# EAGLE schematic example_board (EAGLE 6.5.0)
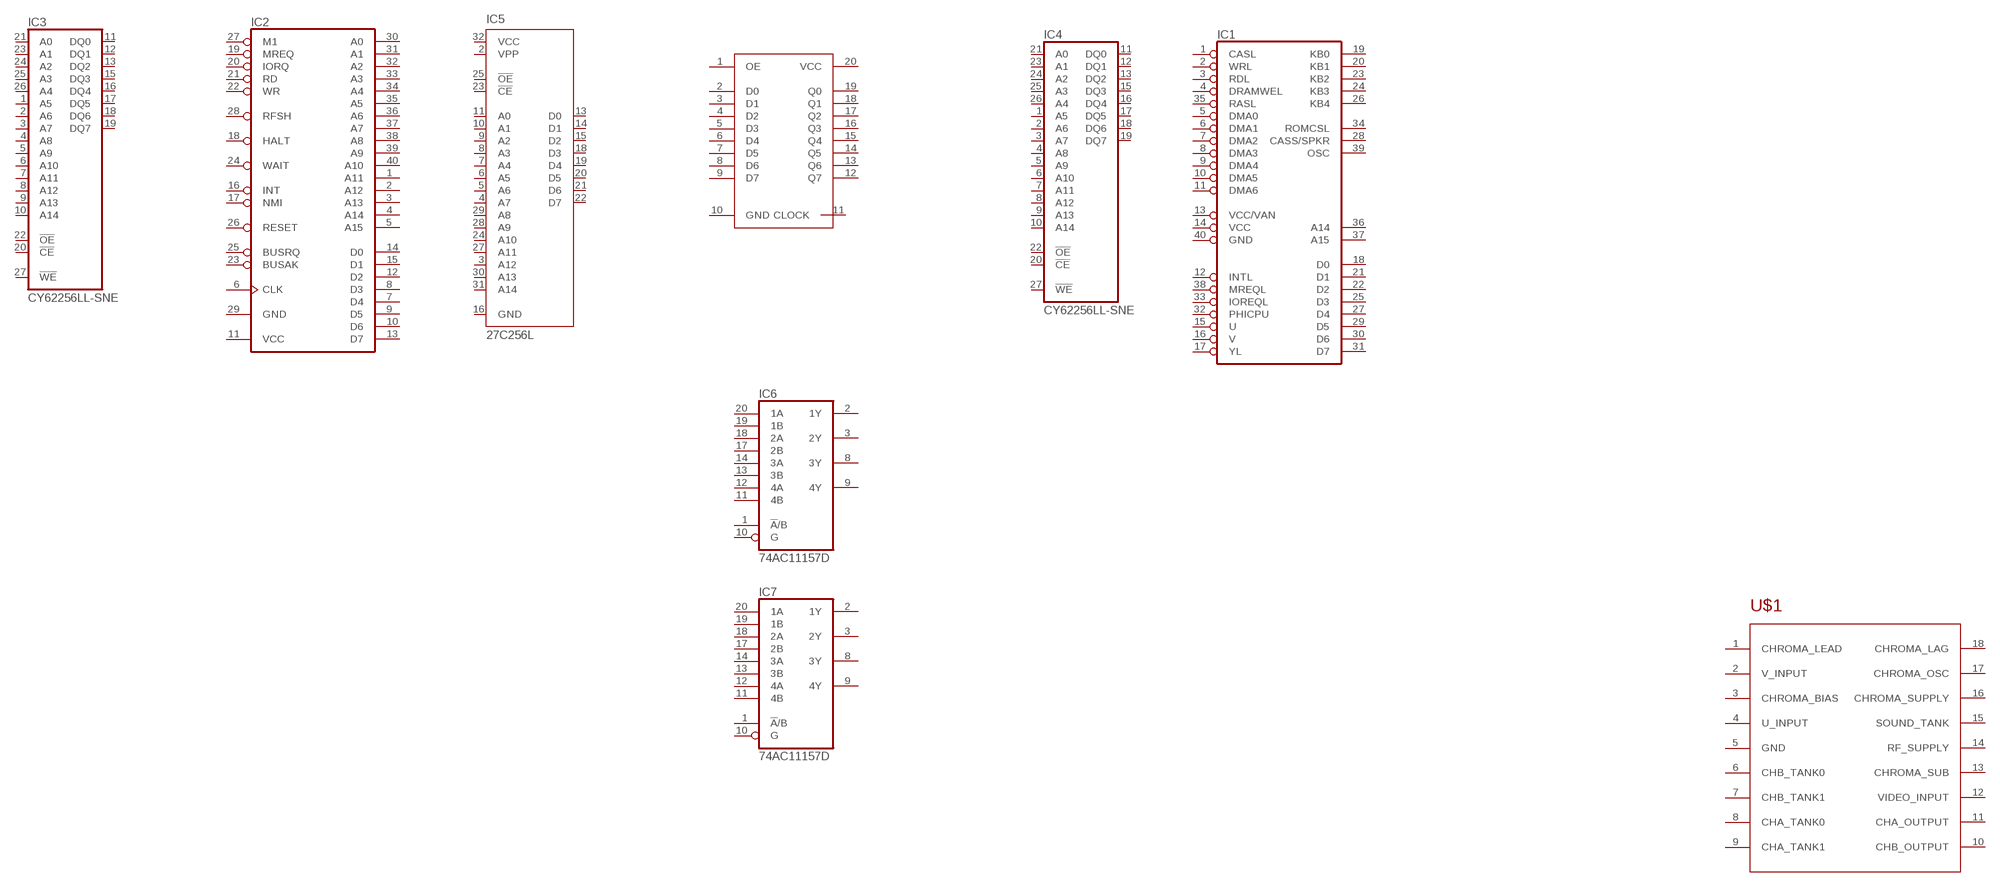
[diagram p0: schematic, sheet 1]

## Parts
IC1  ZXULA  [DIL40]
IC2  Z80CPU  [DIL40]
IC3  CY62256LL-SNE  [SOJ28/3]
IC4  CY62256LL-SNE  [SOJ28/3]
IC5  27C256L  [PLCC-32]
IC6  74AC11157D  [SO20W]
IC7  74AC11157D  [SO20W]
U$1  LM1889  [SOCKET-18]
U$2  MC74HC574A  [SO20W]
Unconnected: IC1.1(CASL) IC1.2(WRL) IC1.3(RDL) IC1.4(DRAMWEL) IC1.5(DMA0) IC1.6(DMA1) IC1.7(DMA2) IC1.8(DMA3) IC1.9(DMA4) IC1.10(DMA5) IC1.11(DMA6) IC1.12(INTL) IC1.13(VCC/VAN) IC1.14(VCC) IC1.15(U) IC1.16(V) IC1.17(YL) IC1.18(D0) IC1.19(KB0) IC1.20(KB1) IC1.21(D1) IC1.22(D2) IC1.23(KB2) IC1.24(KB3) IC1.25(D3) IC1.26(KB4) IC1.27(D4) IC1.28(CASS/SPKR) IC1.29(D5) IC1.30(D6) IC1.31(D7) IC1.32(PHICPU) IC1.33(IOREQL) IC1.34(ROMCSL) IC1.35(RASL) IC1.36(A14) IC1.37(A15) IC1.38(MREQL) IC1.39(OSC) IC1.40(GND) IC2.1(A11) IC2.2(A12) IC2.3(A13) IC2.4(A14) IC2.5(A15) IC2.6(CLK) IC2.7(D4) IC2.8(D3) IC2.9(D5) IC2.10(D6) IC2.12(D2) IC2.13(D7) IC2.14(D0) IC2.15(D1) IC2.16(INT) IC2.17(NMI) IC2.18(HALT) IC2.19(MREQ) IC2.20(IORQ) IC2.21(RD) IC2.22(WR) IC2.23(BUSAK) IC2.24(WAIT) IC2.25(BUSRQ) IC2.26(RESET) IC2.27(M1) IC2.28(RFSH) IC2.30(A0) IC2.31(A1) IC2.32(A2) IC2.33(A3) IC2.34(A4) IC2.35(A5) IC2.36(A6) IC2.37(A7) IC2.38(A8) IC2.39(A9) IC2.40(A10) IC3.1(A5) IC3.2(A6) IC3.3(A7) IC3.4(A8) IC3.5(A9) IC3.6(A10) IC3.7(A11) IC3.8(A12) IC3.9(A13) IC3.10(A14) IC3.11(DQ0) IC3.12(DQ1) IC3.13(DQ2) IC3.15(DQ3) IC3.16(DQ4) IC3.17(DQ5) IC3.18(DQ6) IC3.19(DQ7) IC3.20(!CE) IC3.21(A0) IC3.22(!OE) IC3.23(A1) IC3.24(A2) IC3.25(A3) IC3.26(A4) IC3.27(!WE) IC4.1(A5) IC4.2(A6) IC4.3(A7) IC4.4(A8) IC4.5(A9) IC4.6(A10) IC4.7(A11) IC4.8(A12) IC4.9(A13) IC4.10(A14) IC4.11(DQ0) IC4.12(DQ1) IC4.13(DQ2) IC4.15(DQ3) IC4.16(DQ4) IC4.17(DQ5) IC4.18(DQ6) IC4.19(DQ7) IC4.20(!CE) IC4.21(A0) IC4.22(!OE) IC4.23(A1) IC4.24(A2) IC4.25(A3) IC4.26(A4) IC4.27(!WE) IC5.2(VPP) IC5.3(A12) IC5.4(A7) IC5.5(A6) IC5.6(A5) IC5.7(A4) IC5.8(A3) IC5.9(A2) IC5.10(A1) IC5.11(A0) IC5.13(D0) IC5.14(D1) IC5.15(D2) IC5.18(D3) IC5.19(D4) IC5.20(D5) IC5.21(D6) IC5.22(D7) IC5.23(!CE) IC5.24(A10) IC5.25(!OE) IC5.27(A11) IC5.28(A9) IC5.29(A8) IC5.30(A13) IC5.31(A14) IC6.1(!A!/B) IC6.2(1Y) IC6.3(2Y) IC6.8(3Y) IC6.9(4Y) IC6.10(G) IC6.11(4B) IC6.12(4A) IC6.13(3B) IC6.14(3A) IC6.17(2B) IC6.18(2A) IC6.19(1B) IC6.20(1A) IC7.1(!A!/B) IC7.2(1Y) IC7.3(2Y) IC7.8(3Y) IC7.9(4Y) IC7.10(G) IC7.11(4B) IC7.12(4A) IC7.13(3B) IC7.14(3A) IC7.17(2B) IC7.18(2A) IC7.19(1B) IC7.20(1A) U$1.1(CHROMA_LEAD) U$1.2(V_INPUT) U$1.3(CHROMA_BIAS) U$1.4(U_INPUT) U$1.5(GND) U$1.6(CHB_TANK0) U$1.7(CHB_TANK1) U$1.8(CHA_TANK0) U$1.9(CHA_TANK1) U$1.10(CHB_OUTPUT) U$1.11(CHA_OUTPUT) U$1.12(VIDEO_INPUT) U$1.13(CHROMA_SUB) U$1.14(RF_SUPPLY) U$1.15(SOUND_TANK) U$1.16(CHROMA_SUPPLY) U$1.17(CHROMA_OSC) U$1.18(CHROMA_LAG) U$2.1(OE) U$2.2(D0) U$2.3(D1) U$2.4(D2) U$2.5(D3) U$2.6(D4) U$2.7(D5) U$2.8(D6) U$2.9(D7) U$2.10(GND) U$2.11(CLOCK) U$2.12(Q7) U$2.13(Q6) U$2.14(Q5) U$2.15(Q4) U$2.16(Q3) U$2.17(Q2) U$2.18(Q1) U$2.19(Q0) U$2.20(VCC)

## Power pins joined to a net without a drawn wire
GND: IC2.29(GND) IC3.14(GND) IC4.14(GND) IC5.16(GND) IC6.4(GND) IC6.5(GND) IC6.6(GND) IC6.7(GND) IC7.4(GND) IC7.5(GND) IC7.6(GND) IC7.7(GND)
VCC: IC2.11(VCC) IC3.28(VCC) IC4.28(VCC) IC5.32(VCC) IC6.15(VCC) IC6.16(VCC) IC7.15(VCC) IC7.16(VCC)

## Library data of the parts
IC1 = ZED_EX_SPECTRUM:ZXULA: ZX Spectrum Custom ULA
IC2 = zilog:Z80CPU: Z80 FAMILY DEVICE
IC3 IC4 = memory-sram:CY62256LL-?*: 256K (32K x 8) CMOS-Static RAM Source: http://download.cypress.com.edgesuite.net/design_resources/datasheets/contents/cy62256_8.pdf
IC5 = microchip:27*256: CMOS EPROM 256 K (32 K x 8), low voltage; MPN: AT27C256R-70JU; OC_FARNELL: 1095779; OC_NEWARK: 96K6554
IC6 IC7 = 74ac-logic:74AC11157: Quadruple 2 to 1 line DATA SELECTOR/MULTIPLEXER
U$1 = ZED_EX_SPECTRUM:LM1889: LM1889 TV Video Modulator
U$2 = zx_ULA:MC74HC574A: Octal 3-State Noninverting D Flip Flop